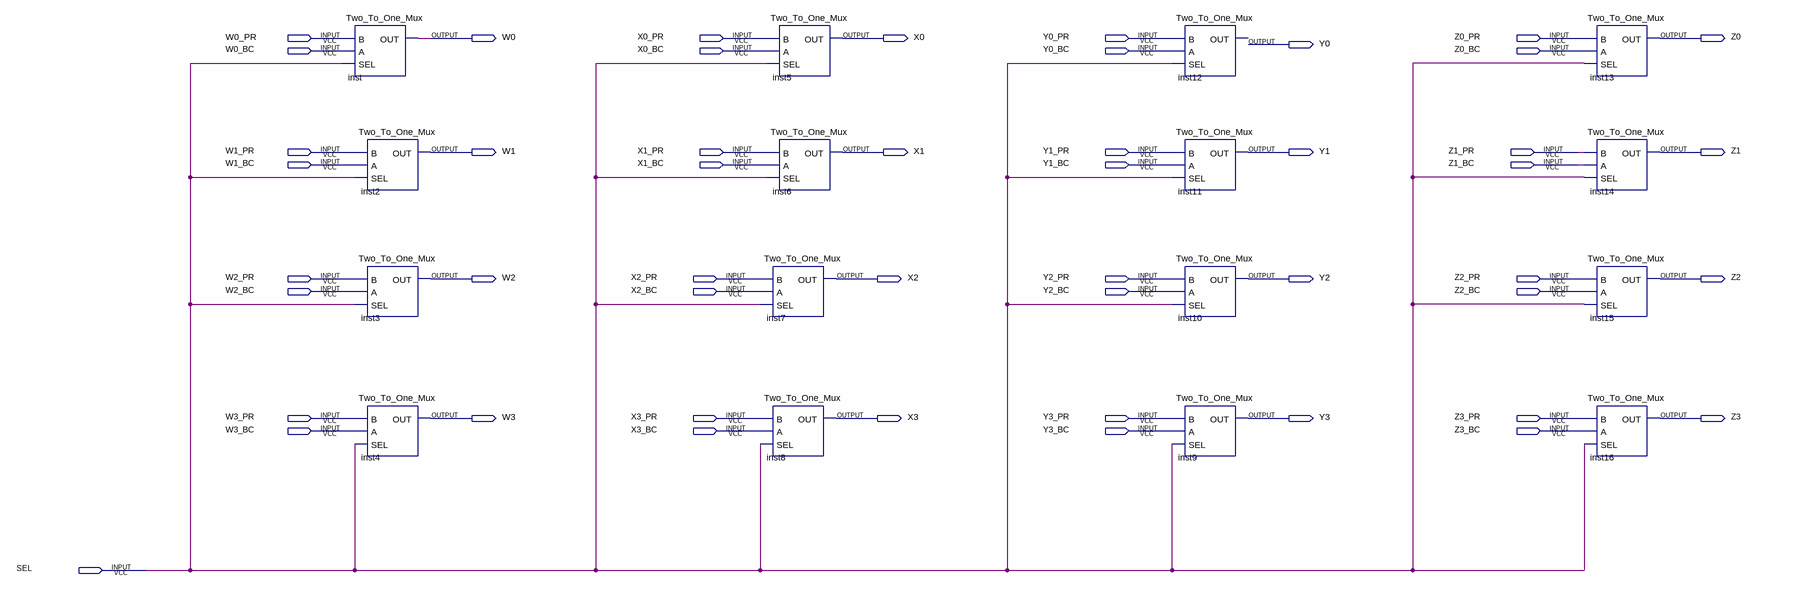
[diagram p0: schematic sheet]
// Quartus schematic Sixteen_To_Eight_Mux.bdf as structural Verilog: 16 symbols, 49 pins
module Sixteen_To_Eight_Mux (
  input  W0_PR,
  input  X0_PR,
  input  Y0_PR,
  input  Z0_PR,
  input  W0_BC,
  input  X0_BC,
  input  Y0_BC,
  input  Z0_BC,
  input  W1_PR,
  input  X1_PR,
  input  Y1_PR,
  input  Z1_PR,
  input  W1_BC,
  input  X1_BC,
  input  Y1_BC,
  input  Z1_BC,
  input  W2_PR,
  input  X2_PR,
  input  Y2_PR,
  input  Z2_PR,
  input  W2_BC,
  input  X2_BC,
  input  Y2_BC,
  input  Z2_BC,
  input  W3_PR,
  input  X3_PR,
  input  Y3_PR,
  input  Z3_PR,
  input  W3_BC,
  input  X3_BC,
  input  Y3_BC,
  input  Z3_BC,
  input  SEL,
  output W0,
  output X0,
  output Z0,
  output Y0,
  output W1,
  output X1,
  output Y1,
  output Z1,
  output W2,
  output X2,
  output Y2,
  output Z2,
  output W3,
  output X3,
  output Y3,
  output Z3
);

  Two_To_One_Mux inst (.B(W0_PR), .A(W0_BC), .SEL(SEL), .OUT(W0));
  Two_To_One_Mux inst2 (.B(W1_PR), .A(W1_BC), .SEL(SEL), .OUT(W1));
  Two_To_One_Mux inst3 (.B(W2_PR), .A(W2_BC), .SEL(SEL), .OUT(W2));
  Two_To_One_Mux inst4 (.B(W3_PR), .A(W3_BC), .SEL(SEL), .OUT(W3));
  Two_To_One_Mux inst5 (.B(X0_PR), .A(X0_BC), .SEL(SEL), .OUT(X0));
  Two_To_One_Mux inst6 (.B(X1_PR), .A(X1_BC), .SEL(SEL), .OUT(X1));
  Two_To_One_Mux inst7 (.B(X2_PR), .A(X2_BC), .SEL(SEL), .OUT(X2));
  Two_To_One_Mux inst8 (.B(X3_PR), .A(X3_BC), .SEL(SEL), .OUT(X3));
  Two_To_One_Mux inst12 (.B(Y0_PR), .A(Y0_BC), .SEL(SEL));  // open: OUT
  Two_To_One_Mux inst11 (.B(Y1_PR), .A(Y1_BC), .SEL(SEL), .OUT(Y1));
  Two_To_One_Mux inst10 (.B(Y2_PR), .A(Y2_BC), .SEL(SEL), .OUT(Y2));
  Two_To_One_Mux inst9 (.B(Y3_PR), .A(Y3_BC), .SEL(SEL), .OUT(Y3));
  Two_To_One_Mux inst13 (.B(Z0_PR), .A(Z0_BC), .SEL(SEL), .OUT(Z0));
  Two_To_One_Mux inst14 (.B(Z1_PR), .A(Z1_BC), .SEL(SEL), .OUT(Z1));
  Two_To_One_Mux inst15 (.B(Z2_PR), .A(Z2_BC), .SEL(SEL), .OUT(Z2));
  Two_To_One_Mux inst16 (.B(Z3_PR), .A(Z3_BC), .SEL(SEL), .OUT(Z3));
endmodule
